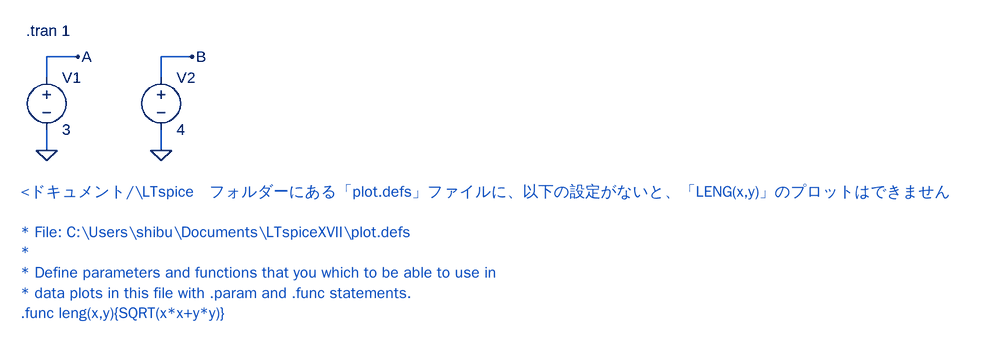
[diagram p0: schematic Fig_3-48_FUNC_PLT.asc]
Fig_3-48_FUNC_PLT.asc, the LTspice schematic file:
Version 4
SHEET 1 1280 680
WIRE 96 96 48 96
WIRE 272 96 224 96
WIRE 48 128 48 96
WIRE 224 128 224 96
WIRE 48 240 48 208
WIRE 224 240 224 208
FLAG 48 240 0
FLAG 224 240 0
FLAG 96 96 A
FLAG 272 96 B
SYMBOL voltage 48 112 R0
SYMATTR InstName V1
SYMATTR Value 3
SYMBOL voltage 224 112 R0
SYMATTR InstName V2
SYMATTR Value 4
TEXT 16 56 Left 2 !.tran 1
TEXT 8 304 Left 2 ;<ドキュメント/\\LTspice　フォルダーにある「plot.defs」ファイルに、以下の設定がないと、「LENG(x,y)」のプロットはできません　\n \n* File: C:\\Users\\shibu\\Documents\\LTspiceXVII\\plot.defs\n*\n* Define parameters and functions that you which to be able to use in\n* data plots in this file with .param and .func statements.\n.func leng(x,y){SQRT(x*x+y*y)}

The netlist it stands for:
* Fig_3-48_FUNC_PLT.asc
V1 A 0 3
V2 B 0 4
.tran 1
* <ドキュメント/\LTspice　フォルダーにある「plot.defs」ファイルに、以下の設定がないと、「LENG(x,y)」のプロットはできません
* * File: C:\Users\shibu\Documents\LTspiceXVII\plot.defs
* *
* * Define parameters and functions that you which to be able to use in
* * data plots in this file with .param and .func statements.
* .func leng(x,y){SQRT(x*x+y*y)}
.backanno
.end